# Altium schematic sheet iot.SchDoc
size A
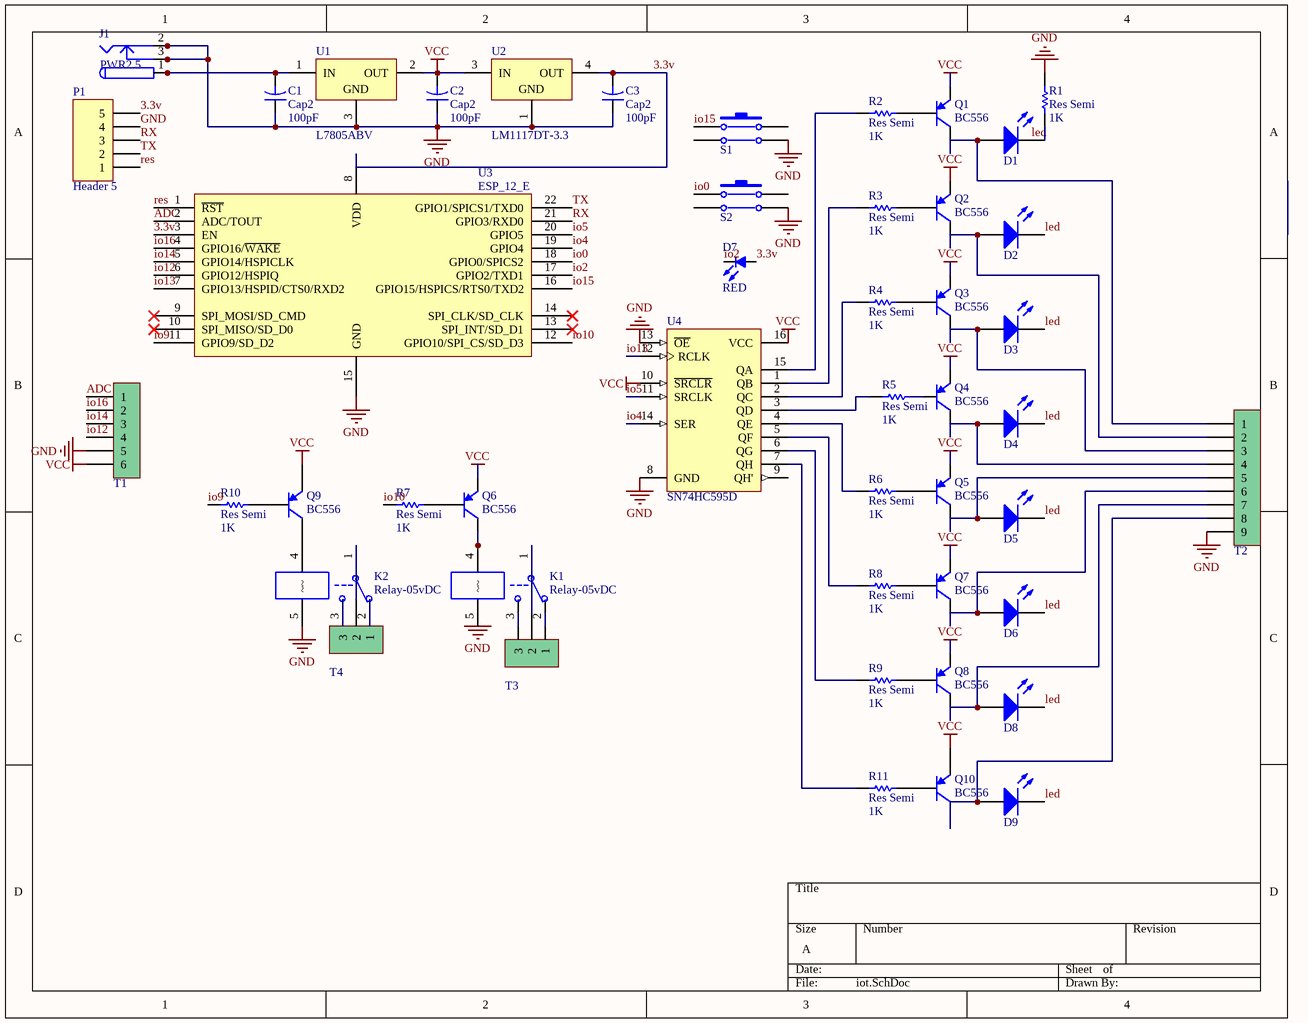
[diagram p0: iot.SchDoc]

## Parts
C1  Cap2  value 100pF  [CAPR5-4X5]
C2  Cap2  value 100pF  [CAPR5-4X5]
C3  Cap2  value 100pF  [CAPR5-4X5]
D1  LED 3mm  [LED-3mm]  (value not drawn)
D2  LED 3mm  [LED-3mm]  (value not drawn)
D3  LED 3mm  [LED-3mm]  (value not drawn)
D4  LED 3mm  [LED-3mm]  (value not drawn)
D5  LED 3mm  [LED-3mm]  (value not drawn)
D6  LED 3mm  [LED-3mm]  (value not drawn)
D7  COLOR: RED  [LED-5mm]  (hidden comment: MODEL)
D8  LED 3mm  [LED-3mm]  (value not drawn)
D9  LED 3mm  [LED-3mm]  (value not drawn)
J1  PWR2.5  [KLD-0202]
K1  Relay-05vDC  [Relays]
K2  Relay-05vDC  [Relays]
P1  Header 5  [HDR1X5]
Q1  BC556  [29-04]
Q2  BC556  [29-04]
Q3  BC556  [29-04]
Q4  BC556  [29-04]
Q5  BC556  [29-04]
Q6  BC556  [29-04]
Q7  BC556  [29-04]
Q8  BC556  [29-04]
Q9  BC556  [29-04]
Q10  BC556  [29-04]
R1  Res Semi  value 1K  [AXIAL-0.5]
R2  Res Semi  value 1K  [AXIAL-0.5]
R3  Res Semi  value 1K  [AXIAL-0.5]
R4  Res Semi  value 1K  [AXIAL-0.5]
R5  Res Semi  value 1K  [AXIAL-0.5]
R6  Res Semi  value 1K  [AXIAL-0.5]
R7  Res Semi  value 1K  [AXIAL-0.5]
R8  Res Semi  value 1K  [AXIAL-0.5]
R9  Res Semi  value 1K  [AXIAL-0.5]
R10  Res Semi  value 1K  [AXIAL-0.5]
R11  Res Semi  value 1K  [AXIAL-0.5]
S1  PB-4pin  [PB-4pin]  (value not drawn)
S2  PB-4pin  [PB-4pin]  (value not drawn)
T1  Phoenix terminal  [phoenix terminal 6]  (value not drawn)
T2  Phoenix terminal  [phoenix terminal 9]  (value not drawn)
T3  Phoenix terminal  [phoenix terminal 3]  (value not drawn)
T4  Phoenix terminal  [phoenix terminal 3]  (value not drawn)
U1  L7805ABV  [TO220ABN]
U2  LM1117DT-3.3  [TD03B_N]
U3  ESP_12_E  [ESP_12_E]
U4  SN74HC595D  [D016_N]

## Nets
GND: C1.1 C2.1 C3.1 J1.2 J1.2A J1.2B J1.3 J1.3A J1.3B K2.5 P1.4 R1.2 S1.4 S2.4 T1.5 T2.9 U1.3(GND) U2.1(GND) U3.15(GND) U4.8(GND) U4.13(~{OE})
VCC: C2.2 Q1.3(E) Q3.3(E) Q4.3(E) Q5.3(E) Q6.3(E) Q7.3(E) Q8.3(E) Q9.3(E) Q10.3(E) T1.6 U1.2(OUT) U2.3(IN) U4.10(~{SRCLR}) U4.16(VCC)
3.3v: C3.2 D7.1(A) P1.5 U2.4(OUT) U3.3(EN) U3.8(VDD)
ADC: T1.1 U3.2(ADC/TOUT)
io0: S2.1 U3.18(GPIO0/SPICS2)
io2: D7.2(K) U3.17(GPIO2/TXD1)
io4: U3.19(GPIO4) U4.14(SER)
io5: U3.20(GPIO5) U4.11(SRCLK)
io9: R10.1 U3.11(GPIO9/SD_D2)
io10: R7.1 U3.12(GPIO10/SPI_CS/SD_D3)
io12: T1.4 U3.6(GPIO12/HSPIQ)
io13: U3.7(GPIO13/HSPID/CTS0/RXD2) U4.12(RCLK)
io14: T1.3 U3.5(GPIO14/HSPICLK)
io15: S1.1 U3.16(GPIO15/HSPICS/RTS0/TXD2)
io16: T1.2 U3.4(GPIO16/~{WAKE})
led: D2.2(K) D3.2(K) D4.2(K) D5.2(K) D6.2(K) D8.2(K) D9.2(K)
res: P1.1 U3.1(~{RST})
RX: P1.3 U3.21(GPIO3/RXD0)
TX: P1.2 U3.22(GPIO1/SPICS1/TXD0)
NetC1_2: C1.2 J1.1 J1.1A J1.1B U1.1(IN)
NetD1_1: D1.1(A) Q1.1(C) T2.1
NetD1_2: D1.2(K) R1.1
NetD2_1: D2.1(A) Q2.1(C) T2.2
NetD3_1: D3.1(A) Q3.1(C) T2.3
NetD4_1: D4.1(A) Q4.1(C) T2.4
NetD5_1: D5.1(A) Q5.1(C) T2.5
NetD6_1: D6.1(A) Q7.1(C) T2.6
NetD8_1: D8.1(A) Q8.1(C) T2.7
NetD9_1: D9.1(A) Q10.1(C) T2.8
NetK1_1: K1.1(COM) T3.2
NetK1_2: K1.2(NC) T3.1
NetK1_3: K1.3(NO) T3.3
NetK1_4: K1.4 Q6.1(C)
NetK2_1: K2.1(COM) T4.2
NetK2_2: K2.2(NC) T4.1
NetK2_3: K2.3(NO) T4.3
NetK2_4: K2.4 Q9.1(C)
NetQ1_2: Q1.2(B) R2.2
NetQ2_2: Q2.2(B) R3.2
NetQ3_2: Q3.2(B) R4.2
NetQ4_2: Q4.2(B) R5.2
NetQ5_2: Q5.2(B) R6.2
NetQ6_2: Q6.2(B) R7.2
NetQ7_2: Q7.2(B) R8.2
NetQ8_2: Q8.2(B) R9.2
NetQ9_2: Q9.2(B) R10.2
NetQ10_2: Q10.2(B) R11.2
NetR2_1: R2.1 U4.15(QA)
NetR3_1: R3.1 U4.1(QB)
NetR4_1: R4.1 U4.2(QC)
NetR5_1: R5.1 U4.3(QD)
NetR6_1: R6.1 U4.4(QE)
NetR8_1: R8.1 U4.5(QF)
NetR9_1: R9.1 U4.6(QG)
NetR11_1: R11.1 U4.7(QH)

Not connected (* = marked no-connect by the designer): K1 5(~); Q2 3(E); S1 2 3; S2 2 3; U3 9(SPI_MOSI/SD_CMD)* 10(SPI_MISO/SD_D0)* 13(SPI_INT/SD_D1)* 14(SPI_CLK/SD_CLK)*; U4 9(QH')

## Notes on the sheet
- Labels drawn without touching a wire or pin: GND, led, VCC

## Library data of the parts
C1-C3 = Cap2: Capacitor; Published: 23-Sep-2002; PackageReference: CAPR5-4X5; Publisher: Altium Limited; PackageDescription: Capacitor; 2 Leads
D1-D6 D8 D9 = LED 3mm: Typical LED; Designer: Seyed Mohsen Ghasemian; Published: 02/04/2012; PackageReference: LED; Publisher: www.picpars.com; PackageDescription: LED; 2 Leads
D7 = LED 5mm: Typical LED
J1 = PWR2.5: Low Voltage Power Supply Connector; Published: 17-Dec-2003; DatasheetDocument: 09-May-2002; Publisher: Altium Limited; ComponentLink1Description: Manufacturer Link; ComponentLink1URL: http://domino.kycon.com/internet/Products.html
K1 K2 = Relay-05vDC: Relay-05vDC-240AC 5A; Designer: Seyed Mohsen Ghasemain; ComponentLinkURL: www.picpars.com
P1 = Header 5: Header, 5-Pin; LatestRevisionDate: 17-Jul-2002; LatestRevisionNote: Re-released for DXP Platform.; Publisher: Altium Limited
Q1-Q10 = BC556: Amplifier Transistor PNP Silicon; Published: 29-Sep-2000; LatestRevisionDate: 17-Jul-2002; LatestRevisionNote: Re-released for DXP Platform.; DatasheetVersion: 1991; PackageVersion: 1996; PackageReference: 29-04; Publisher: Altium Limited; PackageDescription: TO, Flat Index; 3 In-Line, Axial Leads; Body Dia. 4.8mm; Leads 0.48 x 0.5 mm (max); ComponentLink1Description: Manufacturer Link; ComponentLink1URL: http://www.onsemi.com/site/products/landing?taxonomyID=194; ComponentLink2Description: Datasheet; ComponentLink2URL: http://www.onsemi.com/pub/Collateral/BC556B-D.PDF
R1-R11 = Res Semi: Semiconductor Resistor; Published: 8-Jun-2000; LatestRevisionDate: 17-Jul-2002; LatestRevisionNote: Re-released for DXP Platform.; PackageReference: AXIAL-0.5; Publisher: Altium Limited; PackageDescription: Axial Device, Thru-Hole; 2 Leads; 0.5 in Pin Spacing
S1 S2 = PB-4pin: Switch; E-mail: picpars@gmail.com; Designer: Seyed Mohsen Ghasemian; Publisher: www.picpars.com; WEB: www.picpars.com
T1 = Phoenix terminal 6: Terminal 6 Pin; Designer: Seyed Mohsen Ghasemain; E-mail: picpars@gmail.com; ComponentLinkURL: www.picpars.com
T2 = Phoenix terminal 9: Terminal 9 Pin; Designer: Seyed Mohsen Ghasemain; E-mail: picpars@gmail.com; ComponentLinkURL: www.picpars.com
T3 T4 = Phoenix terminal 3: Terminal 3 Pin; Designer: Seyed Mohsen Ghasemain; E-mail: picpars@gmail.com; ComponentLinkURL: www.picpars.com
U1 = L7805ABV: Precision 1A Regulator; Note: Tab is connected to pin 3 (GND).; Published: 24-Aug-2001; LatestRevisionDate: 17-Jul-2002; LatestRevisionNote: Re-released for DXP Platform.; DatasheetVersion: Nov-1999; PackageVersion: Jun-1998; PackageReference: TO220ABN; Publisher: Altium Limited; PackageDescription: TO, Thru-Hole, Vertical, Heatsink Mounted; 3 In-Line Leads; Pitch 2.54 mm; Pin sequence 1, 3, 2; ComponentLink1Description: Manufacturer Link; ComponentLink1URL: http://www.st.com/; ComponentLink2Description: Datasheet; ComponentLink2URL: http://www.st.com/stonline/products/literature/ds/2144/l7805ab.pdf
U2 = LM1117DT-3.3: 800mA Low-Dropout Linear Regulator; Manufacturer: National Semiconductor; CompType: LDO IC; PackageTopMarking: NSUZXYTT*LM1117*DT-3.3; PowerWise: N; Published: 4-Dec-2008; DatasheetVersion: Apr-2006; PackageVersion: revC, Apr-2003; PackageReference: TD03B; Publisher: Altium Limited; PackageDescription: TO252, Molded, Jedec, 6.8 x 6.10 x 2.30mm Body, 3 Lead, 2.28mm Pitch, Surface Mount; PartNumber: LM1117DT-3.3; RoHS: O; PinCount: 3; DigiKeyPartNumber: LM1117DT-3.3-ND; Code_JEDEC: TO-252-AA; ComponentLink1Description: LM1117 Datasheet; ComponentLink1URL: http://www.national.com/ds/LM/LM1117.pdf; ComponentLink2Description: LM1117 Web Page; ComponentLink2URL: http://www.national.com/pf/LM/LM1117.html; ComponentLink3Description: TD03B Package Page; ComponentLink3URL: http://www.national.com/packaging/folders/td03b.html
U3 = ESP_12_E: ESP-12 Wi-Fi Module by AI-Thinker; IC: ESP8266-EX; Vendor: Ai-thinker
U4 = SN74HC595D: 8-Bit Shift Register with 3-State Output Registers; Published: 8-Jun-2000; LatestRevisionDate: 13-Apr-2006; LatestRevisionNote: IPC-7351 Footprint Added.; DatasheetVersion: May-1997; PackageVersion: Jan-1998; PackageReference: D016; Publisher: Altium Limited; PackageDescription: 16-Pin Small Outline Integrated Circuit 1.27 mm Pitch; Code_IPC: SOIC127P600-16; ComponentLink1Description: Manufacturer Link; ComponentLink1URL: http://www.ti.com/; ComponentLink2Description: Datasheet; ComponentLink2URL: http://www-s.ti.com/sc/ds/sn74hc595.pdf